# EAGLE design goodfet30 (EAGLE 5.06)
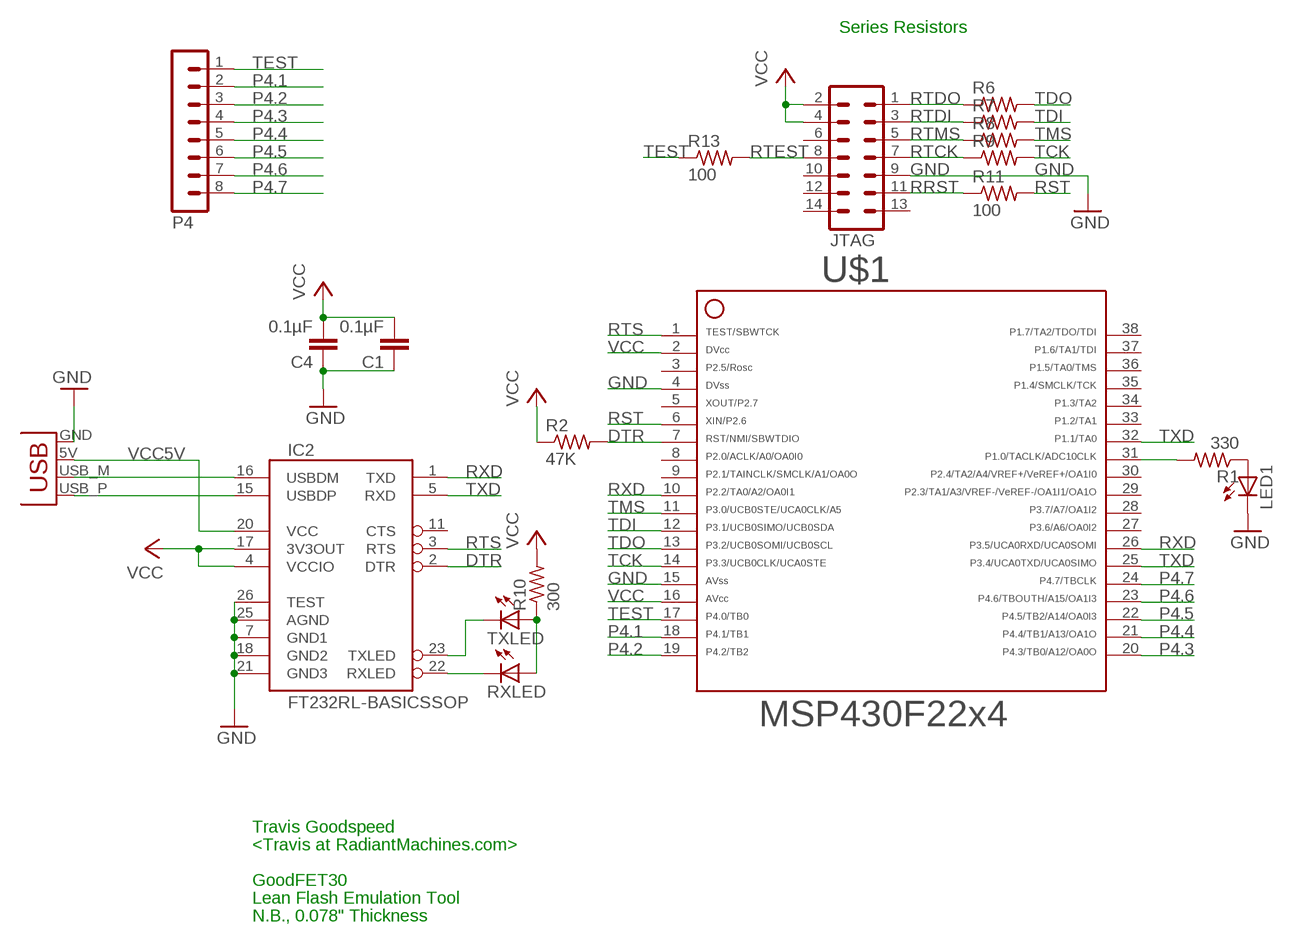
[diagram p0: schematic, sheet 1]

## Parts
C1  0.1µF  C-EUC0603  [C0603]
C4  0.1µF  C-EUC0603  [C0603]
IC2  FT232RL-BASICSSOP  [SSOP28DB]
JTAG  MA07-2  [MA07-2]
LED1  LEDCHIP-LED0603  [CHIP-LED0603]
P4  MA08-1  [MA08-1]
R1  330  R-US_R0603  [R0603]
R2  47K  R-US_R0603  [R0603]
R6  100  R-US_R0603  [R0603]
R7  100  R-US_R0603  [R0603]
R8  100  R-US_R0603  [R0603]
R9  100  R-US_R0603  [R0603]
R10  300  R-US_R0603  [R0603]
R11  100  R-US_R0603  [R0603]
R13  100  R-US_R0603  [R0603]
RXLED  LEDCHIP-LED0603  [CHIP-LED0603]
TXLED  LEDCHIP-LED0603  [CHIP-LED0603]
U$1  F22X4---DA38  [DA38]
X1  USBPCB  [USB-A-PCB]

## Nets
DTR: IC2.2(DTR) R2.2 U$1.7
GND: C1.1 C4.1 IC2.7(GND1) IC2.18(GND2) IC2.21(GND3) IC2.25(AGND) IC2.26(TEST) JTAG.9 LED1.C U$1.4 U$1.15 X1.GND
N$3: IC2.15(USBDP) X1.USB_P(D+)
N$4: IC2.16(USBDM) X1.USB_M(D-)
N$6: IC2.22(RXLED) RXLED.C
N$7: IC2.23(TXLED) TXLED.C
N$8: R10.1 RXLED.A TXLED.A
N$9: R1.2 U$1.31
N$10: LED1.A R1.1
P4.1: P4.2 U$1.18
P4.2: P4.3 U$1.19
P4.3: P4.4 U$1.20
P4.4: P4.5 U$1.21
P4.5: P4.6 U$1.22
P4.6: P4.7 U$1.23
P4.7: P4.8 U$1.24
RRST: JTAG.11 R11.1
RST: R11.2 U$1.6
RTCK: JTAG.7 R9.1
RTDI: JTAG.3 R7.1
RTDO: JTAG.1 R6.1
RTEST: JTAG.8 R13.2
RTMS: JTAG.5 R8.1
RTS: IC2.3(RTS) U$1.1
RXD: IC2.1(TXD) U$1.10 U$1.26
TCK: R9.2 U$1.14
TDI: R7.2 U$1.12
TDO: R6.2 U$1.13
TEST: P4.1 R13.1 U$1.17
TMS: R8.2 U$1.11
TXD: IC2.5(RXD) U$1.25 U$1.32
VCC: C1.2 C4.2 IC2.4(VCCIO) IC2.17(3V3OUT) JTAG.2 JTAG.4 R2.1 R10.2 U$1.2 U$1.16
VCC5V: IC2.20(VCC) X1.5V(VBUS)
Unconnected: IC2.11(CTS) JTAG.6 JTAG.10 JTAG.12 JTAG.13 JTAG.14 U$1.3 U$1.5 U$1.8 U$1.9 U$1.27 U$1.28 U$1.29 U$1.30 U$1.33 U$1.34 U$1.35 U$1.36 U$1.37 U$1.38

## Notes on the sheet
- Series Resistors
- Travis Goodspeed
- <Travis at RadiantMachines.com>
- GoodFET30
- Lean Flash Emulation Tool
- N.B., 0.078" Thickness

## Library data of the parts
C1 C4 = rcl:C-EU: CAPACITOR, European symbol
IC2 = SparkFun:FT232RL-BASIC: USB UART This is the simplified version of the FT232RL unit. Only what you need, nothing you don't. Spark Fun Electronics SKU : COM-00650
JTAG = con-lstb:MA07-2: PIN HEADER
LED1 RXLED TXLED = led:LED: LED OSRAM: - CHIPLED LG R971, LG N971, LY N971, LG Q971, LY Q971, LO R971, LY R971 LH N974, LH R974 LS Q976, LO Q976, LY Q976 LO Q996 - Hyper CHIPLED LW Q18S LB Q993, LB Q99A, LB R99A - SideLED LS A670, LO A670, LY A670, LG A670, LP A670 LB A673, LV A673, LT A673, LW A673 LH A674 LY A675 LS A676, LA A676, LO A676, LY A676, LW A676 LS A679, LY A679, LG A679 - Hyper Micro SIDELED® LS Y876, LA Y876, LO Y876, LY Y876 LT Y87S - SmartLED LW L88C, LW L88S LB L89C, LB L89S, LG L890 LS L89K, LO L89K, LY L89K LS L896, LA L896, LO L896, LY L896 - TOPLED LS T670, LO T670, LY T670, LG T670, LP T670 LSG T670, LSP T670, LSY T670, LOP T670, LYG T670 LG T671, LOG T671, LSG T671 LB T673, LV T673, LT T673, LW T673 LH T674 LS T676, LA T676, LO T676, LY T676, LB T676, LH T676, LSB T676, LW T676 LB T67C, LV T67C, LT T67C, LS T67K, LO T67K, LY T67K, LW E67C LS E67B, LA E67B, LO E67B, LY E67B, LB E67C, LV E67C, LT E67C LW T67C LS T679, LY T679, LG T679 LS T770, LO T770, LY T770, LG T770, LP T770 LB T773, LV T773, LT T773, LW T773 LH T774 LS E675, LA E675, LY E675, LS T675 LS T776, LA T776, LO T776, LY T776, LB T776 LHGB T686 LT T68C, LB T68C - Hyper Mini TOPLED® LB M676 - Mini TOPLED Santana® LG M470 LS M47K, LO M47K, LY M47K Source: http://www.osram.convergy.de LUXEON: - LUMILED® LXK2-PW12-R00, LXK2-PW12-S00, LXK2-PW14-U00, LXK2-PW14-V00 LXK2-PM12-R00, LXK2-PM12-S00, LXK2-PM14-U00 LXK2-PE12-Q00, LXK2-PE12-R00, LXK2-PE12-S00, LXK2-PE14-T00, LXK2-PE14-U00 LXK2-PB12-K00, LXK2-PB12-L00, LXK2-PB12-M00, LXK2-PB14-N00, LXK2-PB14-P00, LXK2-PB14-Q00 LXK2-PR12-L00, LXK2-PR12-M00, LXK2-PR14-Q00, LXK2-PR14-R00 LXK2-PD12-Q00, LXK2-PD12-R00, LXK2-PD12-S00 LXK2-PH12-R00, LXK2-PH12-S00 LXK2-PL12-P00, LXK2-PL12-Q00, LXK2-PL12-R00 Source: www.luxeon.com KINGBRIGHT: KA-3528ASYC Source: www.kingbright.com
P4 = con-lstb:MA08-1: PIN HEADER
R1 R2 R10 = rcl:R-US_: RESISTOR, American symbol
R6-R9 R11 R13 = resistor:R-US_: RESISTOR, American symbol
U$1 = TI_MSP430_v13:F22X4---DA38: ***MSP430F22x4***DA38
X1 = SparkFun:USB: USB Connectors USB-B-PTH is fully proven SKU : PRT-00139 USB-miniB is fully proven SKU : PRT-00587 USB-A-PCB is untested. USB-A-H is throughly reviewed, but untested. Spark Fun Electronics SKU : PRT-00437 USB-B-SMT is throughly reviewed, but untested. Needs silkscreen touching up. USB-A-S has not been used/tested USB-MB-H has not been used/tested

## Board
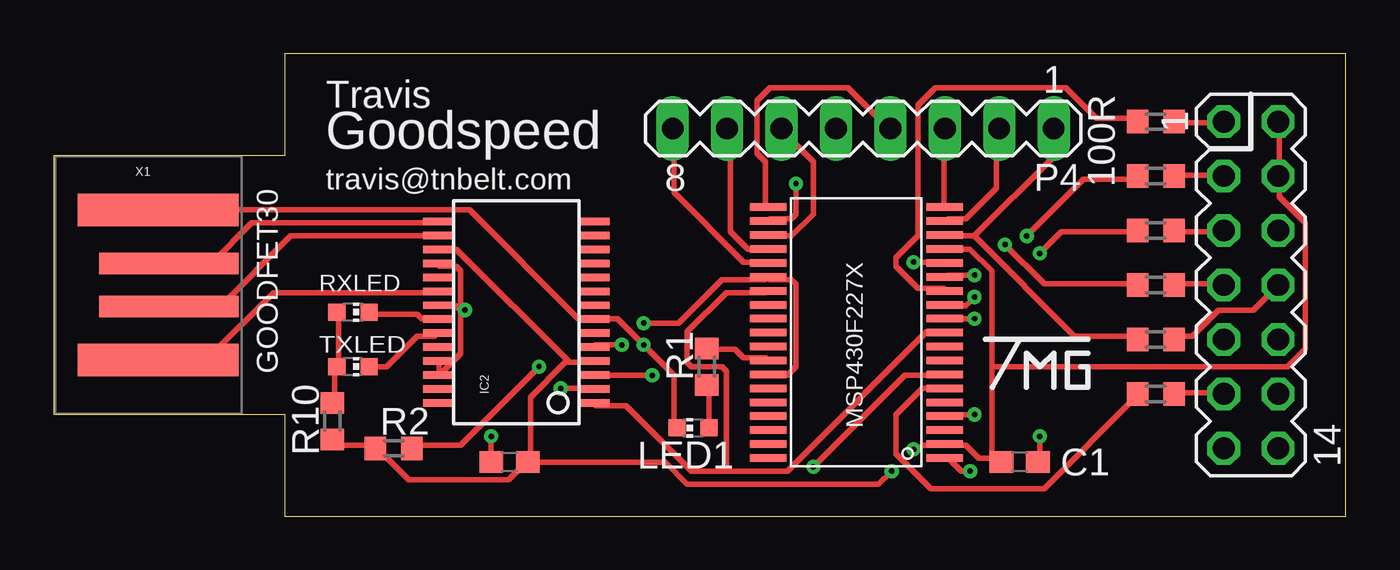
[diagram p1: board, top side]
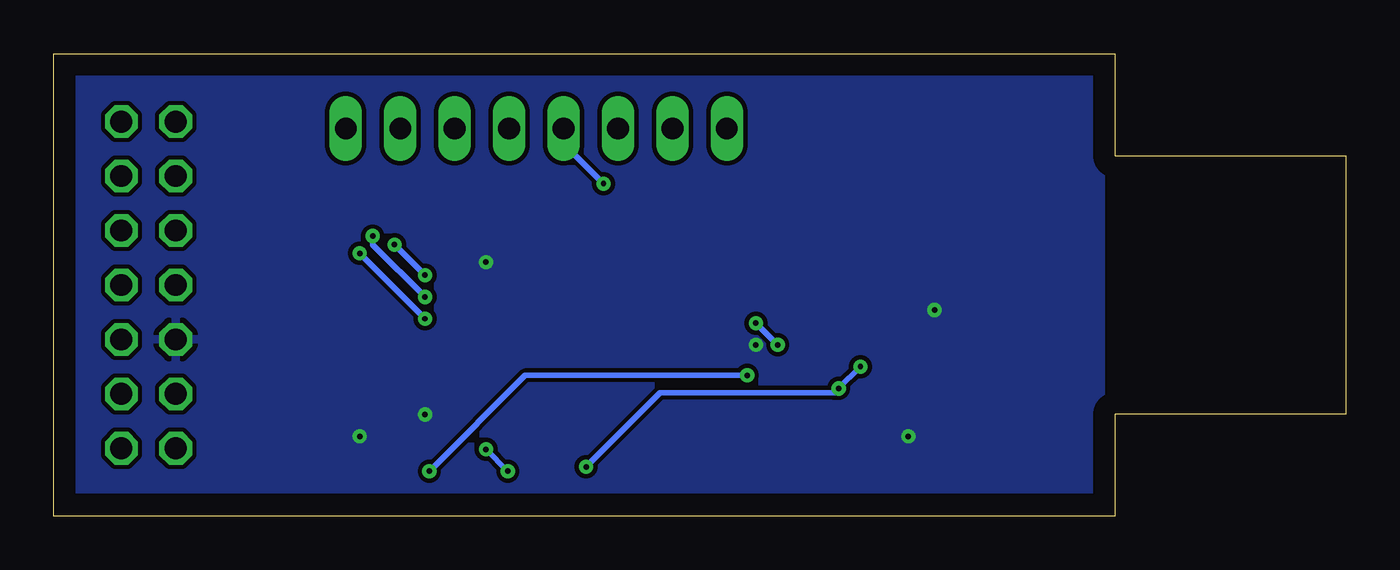
[diagram p2: board, bottom side, seen from below]

Size 60.31 x 21.59 mm. Coordinates in mm from the lower left corner, seen from the top.
Outline: 10.79,0 60.31,0 60.31,21.59 10.79,21.59 10.79,16.83 0,16.83 0,4.76 10.79,4.76 10.79,0
Copper layers (1*16): Top 0.035mm / dielectric 1.5mm / Bottom 0.035mm
Design rules "default *": minimum track width 10mil, minimum drill 10mil, track to track 8mil, track to pad 8mil, pad to pad 8mil, via to via 8mil, smd to smd 8mil, copper to edge 40mil, drill to drill 10mil, minimum pad ring 10mil, minimum via ring 8mil, stop-mask expansion 4mil, vias tented up to drill 0mil, thermal gap 10mil

### Footprints (pad centres in the part's own frame; a part is rotated, then mirrored left to right if it is on the bottom)
C0603 = smd 1.1 x 1: 1 -0.85,0; 2 0.85,0
SSOP28DB = smd 0.348 x 1.397: 1 -4.225,-3.656; 2 -3.575,-3.656; 3 -2.925,-3.656; 4 -2.275,-3.656; 5 -1.625,-3.656; 6 -0.975,-3.656; 7 -0.325,-3.656; 8 0.325,-3.656; 9 0.975,-3.656; 10 1.625,-3.656; 11 2.275,-3.656; 12 2.925,-3.656; 13 3.575,-3.656; 14 4.225,-3.656; 15 4.225,3.656; 16 3.575,3.656; 17 2.925,3.656; 18 2.275,3.656; 19 1.625,3.656; 20 0.975,3.656; 21 0.325,3.656; 22 -0.325,3.656; 23 -0.975,3.656; 24 -1.625,3.656; 25 -2.275,3.656; 26 -2.925,3.656; 27 -3.575,3.656; 28 -4.225,3.656
MA07-2 = drill 1.016 octagon: 1 -7.62,-1.27; 2 -7.62,1.27; 3 -5.08,-1.27; 4 -5.08,1.27; 5 -2.54,-1.27; 6 -2.54,1.27; 7 0,-1.27; 8 0,1.27; 9 2.54,-1.27; 10 2.54,1.27; 11 5.08,-1.27; 12 5.08,1.27; 13 7.62,-1.27; 14 7.62,1.27
CHIP-LED0603 = smd 0.8 x 0.8: A 0,-0.75; C 0,0.75
MA08-1 = drill 1.016 long: 1 -8.89,0; 2 -6.35,0; 3 -3.81,0; 4 -1.27,0; 5 1.27,0; 6 3.81,0; 7 6.35,0; 8 8.89,0
R0603 = smd 1 x 1.1: 1 -0.85,0; 2 0.85,0
DA38 = smd 0.35 x 1.705: 1 -5.85,-4.12; 2 -5.2,-4.12; 3 -4.55,-4.12; 4 -3.9,-4.12; 5 -3.25,-4.12; 6 -2.6,-4.12; 7 -1.95,-4.12; 8 -1.3,-4.12; 9 -0.65,-4.12; 10 0,-4.12; 11 0.65,-4.12; 12 1.3,-4.12; 13 1.95,-4.12; 14 2.6,-4.12; 15 3.25,-4.12; 16 3.9,-4.12; 17 4.55,-4.12; 18 5.2,-4.12; 19 5.85,-4.12; 20 5.85,4.12; 21 5.2,4.12; 22 4.55,4.12; 23 3.9,4.12; 24 3.25,4.12; 25 2.6,4.12; 26 1.95,4.12; 27 1.3,4.12; 28 0.65,4.12; 29 0,4.12; 30 -0.65,4.12; 31 -1.3,4.12; 32 -1.95,4.12; 33 -2.6,4.12; 34 -3.25,4.12; 35 -3.9,4.12; 36 -4.55,4.12; 37 -5.2,4.12; 38 -5.85,4.12
USB-A-PCB = smd 7.5 x 1.5: 5V -0.2,-3.5; GND -0.2,3.5 | smd 6.5 x 1: USB_M 0.3,-1; USB_P 0.3,1

### Placement (x,y rotation side)
C1  45.09,2.54 180 top
C4  21.27,2.54 0 top
IC2  21.59,9.53 90 top
JTAG  55.88,10.79 270 top
LED1  29.85,4.13 90 top
P4  37.78,18.1 180 top
R1  30.48,6.99 90 top
R2  15.88,3.18 0 top
R6  51.44,18.42 180 top
R7  51.44,15.88 180 top
R8  51.44,13.33 180 top
R9  51.44,10.79 180 top
R10  13.02,4.45 270 top
R11  51.44,5.71 180 top
R13  51.44,8.25 0 top
RXLED  13.97,9.53 270 top
TXLED  13.97,6.99 270 top
U$1  37.47,8.57 90 top
X1  5.08,10.79 0 top

### Tracks (layer width: path | path; a pad name or v marks a point on that pad's centre or on a via)
DTR  (via drill 0.25)
  Top 0.254: v22.66,6.99 19,3.33 16.76,3.33 R2.2 | v23.67,5.97 25.1,5.97 IC2.2 | v35.46,2.31 39.73,6.58 41.55,6.58 U$1.7
  Bottom 0.254: v22.66,6.99 v23.67,5.97 23.88,5.77 32,5.77 v35.46,2.31
GND  (via drill 0.25)
  Top 0.254: LED1.C 28.96,4.14 28.96,6.58 v27.53,8 26.31,9.22 25.3,9.22 IC2.7 25.1,9.22 24.49,9.22 19.41,14.3 4.98,14.3 X1.GND | 17.98,6.58 17.98,7.19 IC2.25 | 19,9.63 18.8,9.83 17.98,9.83 IC2.21 | 19,9.63 19,7.6 17.98,6.58 | IC2.26 17.98,6.58 | 19,9.63 19,11.46 18.8,11.66 17.98,11.66 IC2.18 | v20.42,3.73 20.42,2.72 C4.1 | v46.03,3.73 46.03,2.72 C1.1 | v42.98,4.75 41.76,4.75 U$1.4 | v40.13,11.86 41.55,11.86 U$1.15 | 19,9.63 v19.2,9.63
  pour Bottom: 11.75,20.96 59.37,20.96 59.69,1.27 11.43,1.27 11.43,20.64
N$3
  Top 0.254: IC2.15 17.78,13.69 9.25,13.69 7.42,11.86 5.39,11.86 X1.USB_P
N$4
  Top 0.254: IC2.16 17.78,13.08 11.07,13.08 7.82,9.83 5.39,9.83 X1.USB_M
N$6
  Top 0.254: RXLED.C 14.73,9.42 16.97,9.42 17.17,9.22 17.78,9.22 IC2.22
N$7
  Top 0.254: TXLED.C 15.54,6.99 16.97,8.41 17.78,8.41 IC2.23
N$8
  Top 0.254: R10.1 13.11,5.36 13.11,6.99 TXLED.A 13.31,6.99 13.31,9.42 RXLED.A
N$9
  Top 0.254: R1.2 30.58,7.8 31.8,7.8 32.21,7.39 33.22,7.39 U$1.31
N$10
  Top 0.254: LED1.A 30.58,4.14 30.58,5.97 R1.1
P4.1
  Top 0.254: U$1.18 41.76,13.89 42.57,13.89 43.99,15.32 43.99,17.96 P4.2
P4.2
  Top 0.254: U$1.19 41.55,14.5 41.55,17.96 P4.3
P4.3
  Top 0.254: U$1.20 33.22,14.5 33.22,16.54 32.82,16.94 32.82,19.38 33.43,19.99 37.08,19.99 38.91,18.16 P4.4
P4.4  (via drill 0.25)
  Top 0.254: v34.65,15.52 34.65,14.1 34.44,13.89 33.43,13.89 U$1.21
  Bottom 0.254: v34.65,15.52 36.47,17.35 36.47,17.96 P4.5
P4.5
  Top 0.254: U$1.22 33.43,13.08 34.44,13.08 35.46,14.1 35.46,16.54 34.04,17.96 P4.6
P4.6
  Top 0.254: U$1.23 33.22,12.47 32.41,12.47 31.6,13.28 31.6,17.96 P4.7
P4.7
  Top 0.254: U$1.24 33.22,11.86 32.21,11.86 28.96,15.11 28.96,17.96 P4.8
RRST
  Top 0.254: R11.1 52.32,5.77 54.56,5.77 JTAG.11
RST
  Top 0.254: R11.2 50.5,5.56 46.23,1.3 40.95,1.3 39.32,2.92 39.32,4.75 40.54,5.97 41.55,5.97 U$1.6
RTCK
  Top 0.254: R9.1 52.32,10.85 54.56,10.85 JTAG.7
RTDI
  Top 0.254: R7.1 52.32,15.93 54.56,15.93 JTAG.3
RTDO
  Top 0.254: R6.1 52.32,18.36 54.56,18.36 JTAG.1
RTEST
  Top 0.254: R13.2 52.32,8.41 53.14,8.41 54.36,9.63 55.98,9.63 JTAG.8
RTMS
  Top 0.254: R8.1 52.32,13.28 54.56,13.28 JTAG.5
RTS  (via drill 0.25)
  Top 0.254: v27.94,6.58 25.3,6.58 IC2.3 | v42.77,2.11 42.37,2.11 41.76,2.72 U$1.1
  Bottom 0.254: v27.94,6.58 38.3,6.58 v42.77,2.11
RXD
  Top 0.254: 31.39,2.11 34.24,2.11 40.74,8.61 41.55,8.61 U$1.10 | 31.39,2.11 29.77,2.11 26.72,5.16 25.3,5.16 IC2.1 | 31.39,2.11 31.39,6.78 31.19,6.99 29.77,6.99 29.57,7.19 29.57,8.61 31.39,10.44 33.22,10.44 U$1.26
TCK  (via drill 0.25)
  Top 0.254: v44.4,12.68 46.23,10.85 50.5,10.85 R9.2 | v42.98,11.25 41.76,11.25 U$1.14
  Bottom 0.254: v42.98,11.25 v44.4,12.68
TDI  (via drill 0.25)
  Top 0.254: v45.41,13.08 48.06,15.72 50.5,15.72 R7.2 | v42.98,10.24 42.57,9.83 41.76,9.83 U$1.12
  Bottom 0.254: v45.41,13.08 45.41,12.68 v42.98,10.24
TDO
  Top 0.254: R6.2 50.5,18.57 48.67,18.57 47.24,19.99 41.15,19.99 40.34,19.18 40.34,13.08 39.32,12.07 39.32,11.66 40.34,10.64 41.55,10.64 U$1.13
TEST
  Top 0.254: 42.98,13.08 47.65,8.41 50.5,8.41 R13.1 | 42.98,13.08 41.76,13.08 U$1.17 | 42.98,13.08 46.63,16.74 46.63,17.96 P4.1
TMS  (via drill 0.25)
  Top 0.254: v46.03,12.27 47.04,13.28 50.5,13.28 R8.2 | v42.98,9.22 41.76,9.22 U$1.11
  Bottom 0.254: v42.98,9.22 v46.03,12.27
TXD  (via drill 0.25)
  Top 0.254: v26.52,8 25.3,8 IC2.5 | v27.53,9.02 29.16,9.02 31.19,11.05 33.22,11.05 U$1.25 33.43,11.05 34.44,11.05 34.65,10.85 34.65,6.99 34.24,6.58 33.43,6.58 U$1.32
  Bottom 0.254: v26.52,8 v27.53,9.02
VCC  (via drill 0.25)
  Top 0.254: R10.2 13.11,3.53 13.31,3.33 14.93,3.33 R2.1 15.14,3.12 16.56,1.7 21.23,1.7 22.05,2.52 C4.2 | 24.08,7.19 25.1,7.19 IC2.4 | 24.08,7.19 23.88,7.19 22.25,5.56 22.25,2.72 C4.2 | 24.08,7.19 18.8,12.47 17.98,12.47 IC2.17 | JTAG.2 57.2,18.36 57.2,15.93 JTAG.4 57.2,15.72 57.2,14.91 58.42,13.69 58.42,7.8 57.61,6.99 43.79,6.99 | 43.79,2.72 43.18,2.72 42.57,3.33 41.76,3.33 U$1.2 41.55,3.33 40.54,3.33 40.34,3.12 v40.13,3.12 | 43.79,2.72 44.2,2.72 C1.2 43.79,2.72 | 43.79,2.72 43.79,6.99 | 43.79,6.99 43.79,11.46 42.77,12.47 41.76,12.47 U$1.16 | v39.12,2.11 38.51,1.5 29.57,1.5 28.55,2.52 22.25,2.52 C4.2
  Bottom 0.254: v39.12,2.11 v40.13,3.12
VCC5V
  Top 0.254: IC2.20 17.78,10.44 10.26,10.44 7.21,7.39 4.98,7.39 X1.5V

### Text on the board
tPlace: Travis | 100R | Goodspeed | travis@tnbelt.com | GOODFET30
tNames: MSP430F227X